# EAGLE design deska (EAGLE 9.1.3)
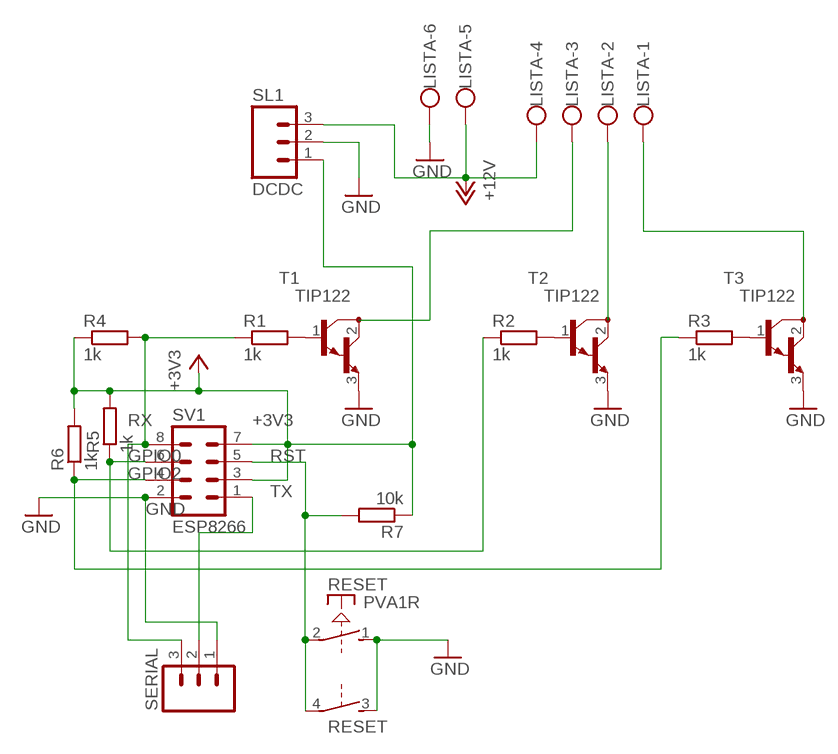
[diagram p0: schematic, sheet 1]

## Parts
LISTA  W237-6  [W237-6]
R1  1k  R-EU_0207/10  [0207/10]
R2  1k  R-EU_0207/10  [0207/10]
R3  1k  R-EU_0207/10  [0207/10]
R4  1k  R-EU_0207/10  [0207/10]
R5  1k  R-EU_0207/10  [0207/10]
R6  1k  R-EU_0207/10  [0207/10]
R7  10k  R-EU_0207/10  [0207/10]
RESET  PVA1R  [PVA1R]
SERIAL  M03  [03P]
SL1  DCDC  M03  [03P]
SV1  ESP8266  MA04-2  [MA04-2]
T1  TIP122  [TO220]
T2  TIP122  [TO220]
T3  TIP122  [TO220]

## Nets
+3V3: R4.1 R5.2 R6.2 R7.1 SL1.1 SV1.3 SV1.7
+12V: LISTA.4 LISTA.5 SL1.3
GND: LISTA.6 RESET.1(1:S) RESET.3(2:S) SERIAL.1 SL1.2 SV1.2 T1.3(E) T2.3(E) T3.3(E)
GPIO0: R2.1 R5.1 SV1.6
GPIO2: R3.1 R6.1 SV1.4
N$1: LISTA.3 T1.2(C)
N$2: LISTA.2 T2.2(C)
N$3: LISTA.1 T3.2(C)
N$4: R1.2 T1.1(B)
N$5: R2.2 T2.1(B)
N$6: R3.2 T3.1(B)
RST: R7.2 RESET.2(1:P) RESET.4(2:P) SV1.5
RX: R1.1 R4.2 SERIAL.3 SV1.8
TX: SERIAL.2 SV1.1

## Library data of the parts
LISTA = con-wago-500:W237-6: WAGO SCREW CLAMP; OC_FARNELL: unknown; OC_NEWARK: unknown
R1-R7 = rcl:R-EU_: RESISTOR, European symbol
RESET = switch-misc:PVA1R: ITT SWITCH
SERIAL SL1 = con-amp-quick:M03: AMP QUICK CONNECTOR; OC_FARNELL: unknown; OC_NEWARK: unknown
SV1 = con-lstb:MA04-2: PIN HEADER; OC_FARNELL: unknown; OC_NEWARK: unknown
T1-T3 = transistor:TIP122: NPN BIPOLAR DARLINGTON TRANSISTOR

## Board
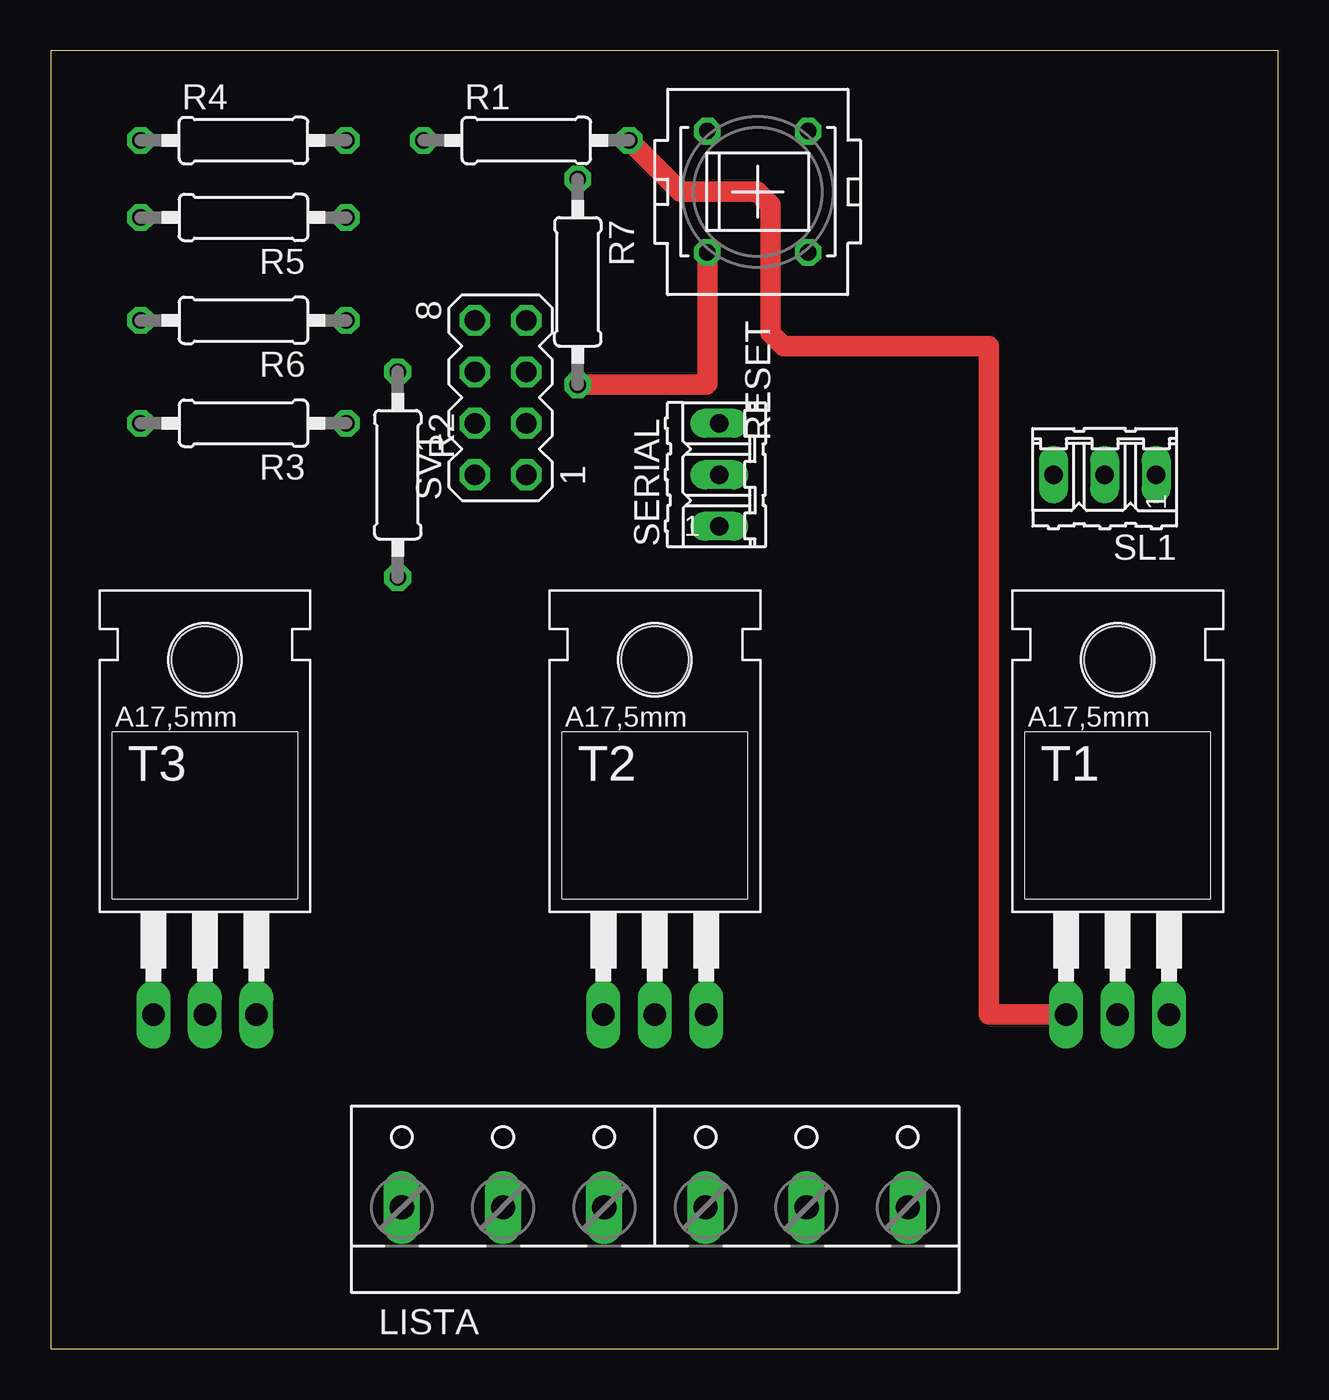
[diagram p1: board, top side]
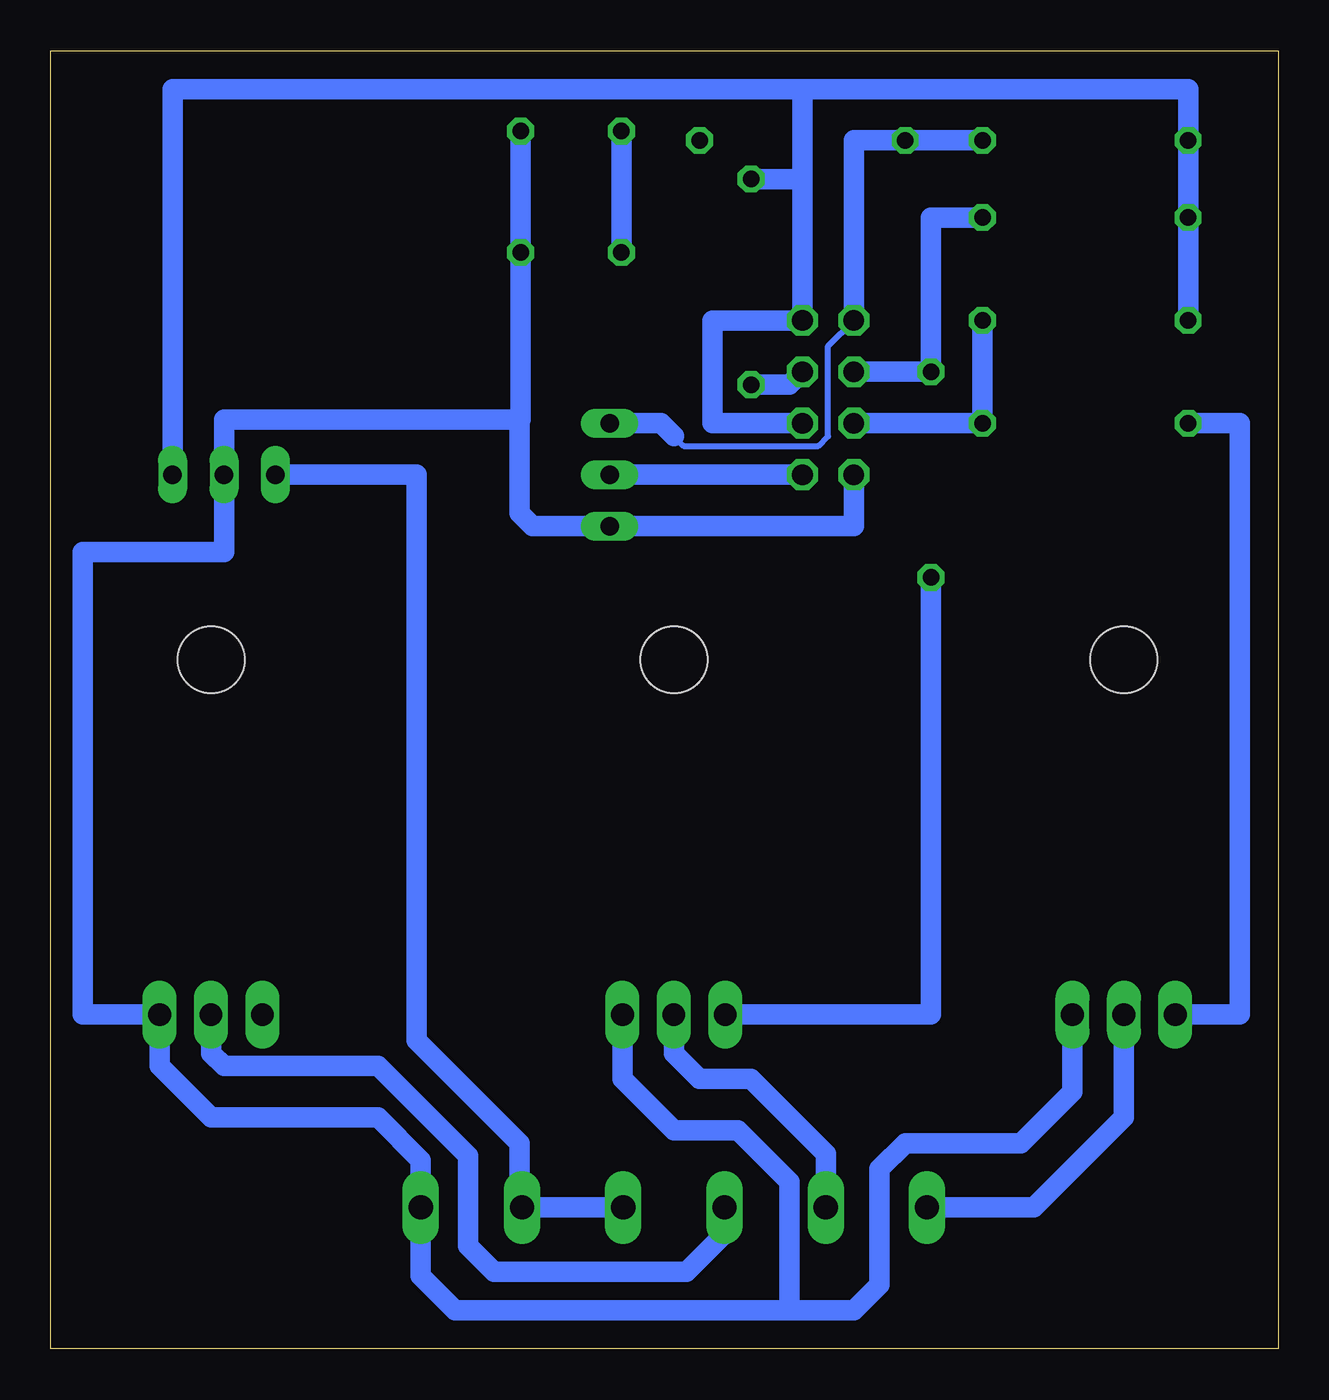
[diagram p2: board, bottom side, seen from below]

Size 60.63 x 64.12 mm. Coordinates in mm from the lower left corner, seen from the top.
Outline: 0,0 60.63,0 60.63,64.12 0,64.12 0,0
Copper layers (1*16): Top 0.035mm / dielectric 1.5mm / Bottom 0.035mm
Design rules "default": minimum track width 10mil, minimum drill 24mil, track to track 8mil, track to pad 8mil, pad to pad 8mil, via to via 8mil, smd to smd 8mil, copper to edge 40mil, drill to drill 8mil, minimum pad ring 10mil, minimum via ring 8mil, stop-mask expansion 4mil, vias tented up to drill 0mil, thermal gap 10mil

### Footprints (pad centres in the part's own frame; a part is rotated, then mirrored left to right if it is on the bottom)
W237-6 = drill 1.194 long: 1 -12.5,-1.27; 2 -7.5,-1.27; 3 -2.5,-1.27; 4 2.5,-1.27; 5 7.5,-1.27; 6 12.5,-1.27
0207/10 = drill 0.813 octagon: 1 -5.08,0; 2 5.08,0
PVA1R = drill 0.813 octagon: 1 -2.997,2.489; 2 -2.997,-2.489; 3 2.997,2.489; 4 2.997,-2.489
03P = drill 0.914 long: 1 -2.54,0; 2 0,0; 3 2.54,0
MA04-2 = drill 1.016 octagon: 1 -3.81,-1.27; 2 -3.81,1.27; 3 -1.27,-1.27; 4 -1.27,1.27; 5 1.27,-1.27; 6 1.27,1.27; 7 3.81,-1.27; 8 3.81,1.27
TO220 = drill 1.118 long: 1 -2.54,-6.35; 2 0,-6.35; 3 2.54,-6.35 | hole 3.302: 0,11.176

### Placement (x,y rotation side)
LISTA  29.84,8.26 0 top
R1  23.5,59.69 0 top
R2  17.14,43.18 270 top
R3  9.53,45.72 180 top
R4  9.53,59.69 0 top
R5  9.53,55.88 180 top
R6  9.53,50.8 180 top
R7  26.04,52.7 270 top
RESET  34.92,57.15 270 top
SERIAL  33.02,43.18 90 top
SL1  52.07,43.18 180 top
SV1  22.23,46.99 90 top
T1  52.7,22.86 0 top
T2  29.84,22.86 0 top
T3  7.62,22.86 0 top

### Tracks (layer width: path | path; a pad name or v marks a point on that pad's centre or on a via)
+3V3
  Bottom 1.016: SV1.3 27.94,45.72 27.94,50.8 SV1.7 23.5,57.78 | R6.2 R5.2 R4.1 4.45,62.23 23.5,62.23 | SL1.1 54.61,62.23 23.5,62.23 | 23.5,62.23 23.5,57.78 | R7.1 23.5,57.78
+12V
  Bottom 1.016: SL1.3 42.55,43.18 42.55,15.24 37.47,10.16 37.47,7.11 LISTA.5 LISTA.4
GND
  Bottom 1.016: RESET.1 RESET.3 37.41,45.9 | 37.41,45.9 46.99,45.9 52.07,45.9 SL1.2 52.07,39.37 59.05,39.37 59.05,16.51 T1.3 55.24,13.97 52.7,11.43 44.45,11.43 42.34,9.32 LISTA.6 42.34,3.61 40.64,1.91 36.83,1.91 34.29,1.91 25.4,1.91 24.13,1.91 | SV1.2 20.95,40.64 SERIAL.1 36.83,40.64 37.47,41.27 37.47,45.9 37.41,45.9 | T2.3 32.38,13.34 29.84,10.79 26.67,10.79 24.13,8.26 24.13,1.91 | 24.13,1.91 20.95,1.91 19.68,3.17 19.68,8.89 18.41,10.16 12.7,10.16 10.16,12.7 T3.3
GPIO0
  Bottom 1.016: SV1.6 R2.1 17.14,55.88 R5.1
GPIO2
  Bottom 1.016: SV1.4 R3.1 R6.1
N$1
  Bottom 1.016: LISTA.3 27.34,5.67 29.21,3.81 38.73,3.81 40.01,5.08 40.01,9.53 44.45,13.97 52.07,13.97 52.7,14.61 T1.2
N$2
  Bottom 1.016: LISTA.2 22.34,9.64 26.04,13.34 28.57,13.34 29.84,14.61 T2.2
N$3
  Bottom 1.016: T3.2 7.62,11.43 12.06,6.99 LISTA.1
N$4
  Top 1.016: T1.1 46.35,16.51 46.35,49.53 36.2,49.53 35.56,50.16 35.56,56.52 34.92,57.15 31.11,57.15 R1.2
N$5
  Bottom 1.016: R2.2 17.14,16.51 T2.1
N$6
  Bottom 1.016: R3.2 1.91,45.72 1.91,16.51 T3.1
RST
  Top 1.016: R7.2 32.38,47.62 32.44,47.68 RESET.4
  Bottom 1.016: R7.2 24.13,47.62 SV1.5 | RESET.2 RESET.4
RX
  Bottom 0.305: 29.84,45.09 29.36,44.6 22.71,44.6 22.23,45.09 22.23,49.53 SV1.8
  Bottom 1.016: SV1.8 20.95,59.69 R1.1 R4.2 | SERIAL.3 30.48,45.72 29.84,45.09
TX
  Bottom 1.016: SV1.1 30.48,43.18 SERIAL.2